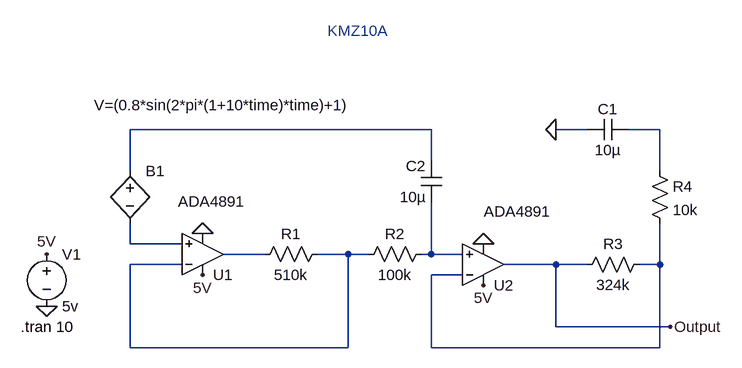
[diagram p0: schematic bv_hall_rpm_1.asc]
bv_hall_rpm_1.asc, the LTspice schematic file:
Version 4.1
SHEET 1 1160 680
WIRE 688 -48 224 -48
WIRE 928 -48 880 -48
WIRE 1040 -48 992 -48
WIRE 688 0 688 -48
WIRE 224 16 224 -48
WIRE 1040 16 1040 -48
WIRE 224 128 224 96
WIRE 304 128 224 128
WIRE 432 144 368 144
WIRE 560 144 512 144
WIRE 592 144 560 144
WIRE 688 144 688 64
WIRE 688 144 672 144
WIRE 736 144 688 144
WIRE 304 160 224 160
WIRE 880 160 800 160
WIRE 928 160 880 160
WIRE 1040 160 1040 96
WIRE 1040 160 1008 160
WIRE 736 176 688 176
WIRE 880 256 880 160
WIRE 1056 256 880 256
WIRE 224 288 224 160
WIRE 560 288 560 144
WIRE 560 288 224 288
WIRE 688 288 688 176
WIRE 1040 288 1040 160
WIRE 1040 288 688 288
FLAG 96 224 0
FLAG 96 144 5V
FLAG 1056 256 Output
FLAG 880 -48 0
FLAG 336 176 5V
FLAG 768 192 5V
FLAG 336 112 0
FLAG 768 128 0
SYMBOL voltage 96 128 R0
WINDOW 123 0 0 Left 0
WINDOW 39 0 0 Left 0
SYMATTR InstName V1
SYMATTR Value 5v
SYMBOL OpAmps\\ADA4891 336 208 M180
WINDOW 3 -38 145 Left 2
SYMATTR InstName U1
SYMBOL OpAmps\\ADA4891 768 224 M180
WINDOW 3 1 146 Left 2
SYMATTR InstName U2
SYMBOL res 528 128 R90
WINDOW 0 0 56 VBottom 2
WINDOW 3 32 56 VTop 2
SYMATTR InstName R1
SYMATTR Value 510k
SYMBOL res 688 128 R90
WINDOW 0 0 56 VBottom 2
WINDOW 3 32 56 VTop 2
SYMATTR InstName R2
SYMATTR Value 100k
SYMBOL res 1024 144 R90
WINDOW 0 0 56 VBottom 2
WINDOW 3 32 56 VTop 2
SYMATTR InstName R3
SYMATTR Value 324k
SYMBOL res 1024 0 R0
SYMATTR InstName R4
SYMATTR Value 10k
SYMBOL cap 992 -64 R90
WINDOW 0 0 32 VBottom 2
WINDOW 3 32 32 VTop 2
SYMATTR InstName C1
SYMATTR Value 10µ
SYMBOL cap 704 64 R180
WINDOW 0 24 56 Left 2
WINDOW 3 24 8 Left 2
SYMATTR InstName C2
SYMATTR Value 10µ
SYMBOL bv 224 0 R0
WINDOW 3 -55 -86 Left 2
SYMATTR InstName B1
SYMATTR Value V=(0.8*sin(2*pi*(1+10*time)*time)+1)
TEXT 56 256 Left 2 !.tran 10
TEXT 528 -200 Left 2 ;KMZ10A

The netlist it stands for:
* bv_hall_rpm_1.asc
V1 5V 0 5v
X§U1 N003 N005 5V 0 N004 ADA4891-1  ; pins In+ In- V+ V- OUT
X§U2 N006 N007 5V 0 Output ADA4891-1  ; pins In+ In- V+ V- OUT
R1 N005 N004 510k
R2 N006 N005 100k
R3 N007 Output 324k
R4 N002 N007 10k
C1 N002 0 10µ
C2 N006 N001 10µ
B1 N001 N003 V=(0.8*sin(2*pi*(1+10*time)*time)+1)
.tran 10
* KMZ10A
.lib ADA4891-1.lib
.backanno
.end